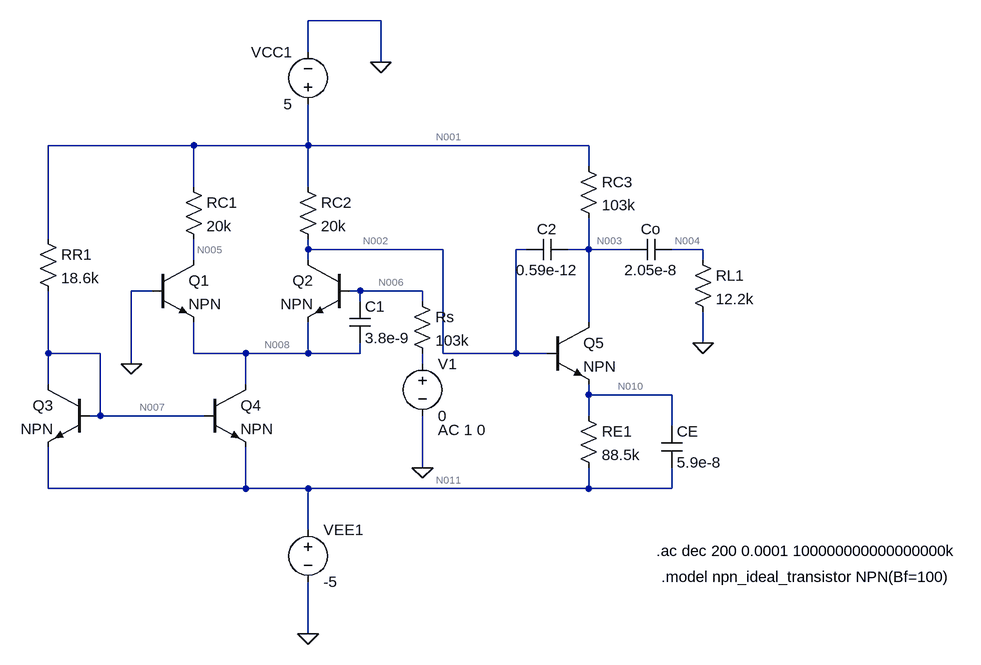
[diagram p0: schematic Circuit.asc]
Circuit.asc, the LTspice schematic file:
Version 4
SHEET 1 1612 1072
WIRE 688 112 576 112
WIRE 576 160 576 112
WIRE 688 176 688 112
WIRE 400 304 176 304
WIRE 576 304 576 240
WIRE 576 304 400 304
WIRE 1008 304 576 304
WIRE 1008 336 1008 304
WIRE 400 368 400 304
WIRE 576 368 576 304
WIRE 176 448 176 304
WIRE 576 464 576 448
WIRE 784 464 576 464
WIRE 912 464 896 464
WIRE 1008 464 1008 416
WIRE 1008 464 976 464
WIRE 1072 464 1008 464
WIRE 1184 464 1136 464
WIRE 400 480 400 448
WIRE 576 480 576 464
WIRE 1184 480 1184 464
WIRE 336 528 304 528
WIRE 656 528 640 528
WIRE 752 528 656 528
WIRE 656 544 656 528
WIRE 752 544 752 528
WIRE 1008 576 1008 464
WIRE 1184 608 1184 560
WIRE 176 624 176 528
WIRE 256 624 176 624
WIRE 400 624 400 576
WIRE 480 624 400 624
WIRE 576 624 576 576
WIRE 576 624 480 624
WIRE 656 624 656 608
WIRE 656 624 576 624
WIRE 784 624 784 464
WIRE 896 624 896 464
WIRE 896 624 784 624
WIRE 944 624 896 624
WIRE 304 640 304 528
WIRE 752 640 752 624
WIRE 176 672 176 624
WIRE 480 672 480 624
WIRE 1008 688 1008 672
WIRE 1136 688 1008 688
WIRE 256 720 256 624
WIRE 256 720 240 720
WIRE 416 720 256 720
WIRE 1008 720 1008 688
WIRE 1136 736 1136 688
WIRE 752 800 752 720
WIRE 176 832 176 768
WIRE 480 832 480 768
WIRE 480 832 176 832
WIRE 576 832 480 832
WIRE 1008 832 1008 800
WIRE 1008 832 576 832
WIRE 1136 832 1136 800
WIRE 1136 832 1008 832
WIRE 576 896 576 832
WIRE 576 1056 576 976
FLAG 1184 608 0
FLAG 576 1056 0
FLAG 688 176 0
FLAG 304 640 0
FLAG 752 800 0
SYMBOL res 384 352 R0
SYMATTR InstName RC1
SYMATTR Value 20k
SYMBOL res 560 352 R0
SYMATTR InstName RC2
SYMATTR Value 20k
SYMBOL Res 992 704 R0
SYMATTR InstName RE1
SYMATTR Value 88.5k
SYMBOL Res 160 432 R0
SYMATTR InstName RR1
SYMATTR Value 18.6k
SYMBOL Res 992 320 R0
SYMATTR InstName RC3
SYMATTR Value 103k
SYMBOL npn 336 480 R0
SYMATTR InstName Q1
SYMBOL npn 944 576 R0
SYMATTR InstName Q5
SYMBOL npn 416 672 R0
SYMATTR InstName Q4
SYMBOL npn 240 672 M0
SYMATTR InstName Q3
SYMBOL npn 640 480 M0
SYMATTR InstName Q2
SYMBOL voltage 576 880 R0
SYMATTR InstName VEE1
SYMATTR Value -5
SYMBOL voltage 576 256 R180
WINDOW 0 24 96 Left 2
WINDOW 3 24 16 Left 2
SYMATTR InstName VCC1
SYMATTR Value 5
SYMBOL Res 1168 464 R0
SYMATTR InstName RL1
SYMATTR Value 12.2k
SYMBOL Voltage 752 624 R0
WINDOW 123 24 118 Left 2
SYMATTR Value2 AC 1 0
SYMATTR InstName V1
SYMATTR Value 0
SYMBOL cap 1136 448 R90
WINDOW 0 0 32 VBottom 2
WINDOW 3 32 32 VTop 2
SYMATTR InstName Co
SYMATTR Value 2.05e-8
SYMBOL cap 1120 736 R0
SYMATTR InstName CE
SYMATTR Value 5.9e-8
SYMBOL cap 976 448 R90
WINDOW 0 0 32 VBottom 2
WINDOW 3 32 32 VTop 2
SYMATTR InstName C2
SYMATTR Value 0.59e-12
SYMBOL cap 640 544 R0
SYMATTR InstName C1
SYMATTR Value 3.8e-9
SYMBOL Res 736 528 R0
SYMATTR InstName Rs
SYMATTR Value 103k
TEXT 1112 928 Left 2 !.ac dec 200 0.0001 100000000000000000k
TEXT 1120 968 Left 2 !.model npn_ideal_transistor NPN(Bf=100)

The netlist it stands for:
* Circuit.asc
RC1 N001 N005 20k
RC2 N001 N002 20k
RE1 N010 N011 88.5k
RR1 N001 N007 18.6k
RC3 N001 N003 103k
Q1 N005 0 N008 0 NPN
Q5 N003 N002 N010 0 NPN
Q4 N008 N007 N011 0 NPN
Q3 N007 N007 N011 0 NPN
Q2 N002 N006 N008 0 NPN
VEE1 N011 0 -5
VCC1 N001 0 5
RL1 N004 0 12.2k
V1 N009 0 0 AC 1 0
Co N004 N003 2.05e-8
CE N010 N011 5.9e-8
C2 N003 N002 0.59e-12
C1 N006 N008 3.8e-9
Rs N006 N009 103k
.model NPN NPN
.model PNP PNP
.lib standard.bjt
.ac dec 200 0.0001 100000000000000000k
.model npn_ideal_transistor NPN(Bf=100)
.backanno
.end

* Results of the author's LTspice run, read from the files saved beside the schematic
* Operating Point, zero values left out:
*   V(n001) = 5 V
*   V(n005) = -722.9 mV
*   V(n002) = 2.812 V
*   V(n010) = 2.09 V
*   V(n011) = -5 V
*   V(n007) = -4.244 V
*   V(n003) = 2.115 V
*   V(n008) = -759.3 mV
*   V(n006) = -59.02 mV
*   Ic(Q2) = 57.31 µA
*   Ib(Q2) = 573.1 nA
*   Ie(Q2) = -57.88 µA
*   Ic(Q3) = 487.3 µA
*   Ib(Q3) = 4.873 µA
*   Ie(Q3) = -492.1 µA
*   Ic(Q4) = 487.3 µA
*   Ib(Q4) = 4.873 µA
*   Ie(Q4) = -492.1 µA
*   Ic(Q5) = 28.01 µA
*   Ib(Q5) = 52.1 µA
*   Ie(Q5) = -80.12 µA
*   Ic(Q1) = 286.1 µA
*   Ib(Q1) = 143.2 µA
*   Ie(Q1) = -429.4 µA
*   I(Rs) = -573.1 nA
*   I(Rc3) = 28.01 µA
*   I(Rr1) = 497 µA
*   I(Re1) = 80.12 µA
*   I(Rc2) = 109.4 µA
*   I(Rc1) = 286.1 µA
*   I(V1) = -573.1 nA
*   I(Vcc1) = -920.6 µA
*   I(Vee1) = 1.064 mA
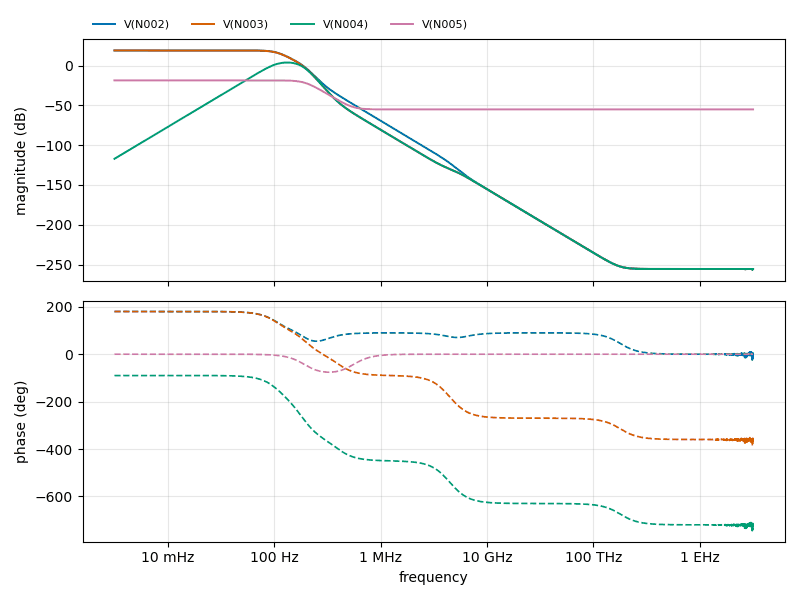
[diagram p1: AC Analysis of Circuit.asc, plotted from the saved traces]
* AC Analysis, 1 run:
*   V(N002): 19.06 dB at 100 µHz, -255.56 dB at 1e+08 THz, peak 19.06 dB at 100 µHz, 3 dB below the peak at 133.6 Hz
*   V(N003): 18.97 dB at 100 µHz, -255.56 dB at 1e+08 THz, peak 18.97 dB at 100 µHz, 3 dB below the peak at 133.1 Hz
*   V(N004): -117.10 dB at 100 µHz, -255.56 dB at 1e+08 THz, peak 3.87 dB at 309 Hz, 3 dB below the peak at 100.3 Hz and 878.8 Hz
*   V(N005): -18.62 dB at 100 µHz, -55.04 dB at 1e+08 THz, peak -18.62 dB at 100 µHz, 3 dB below the peak at 1.415 kHz